# EasyEDA Pro project OpenArtV3改.eprj

# Schematic Schematic1
Create Date: 2023-12-01; Page Name: P1; Project Name: OpenArtV3改; Schematic Name: Schematic1; Update Date: 2024-03-08; Company: 嘉立创EDA; Page Size: A4; Version: V1.0
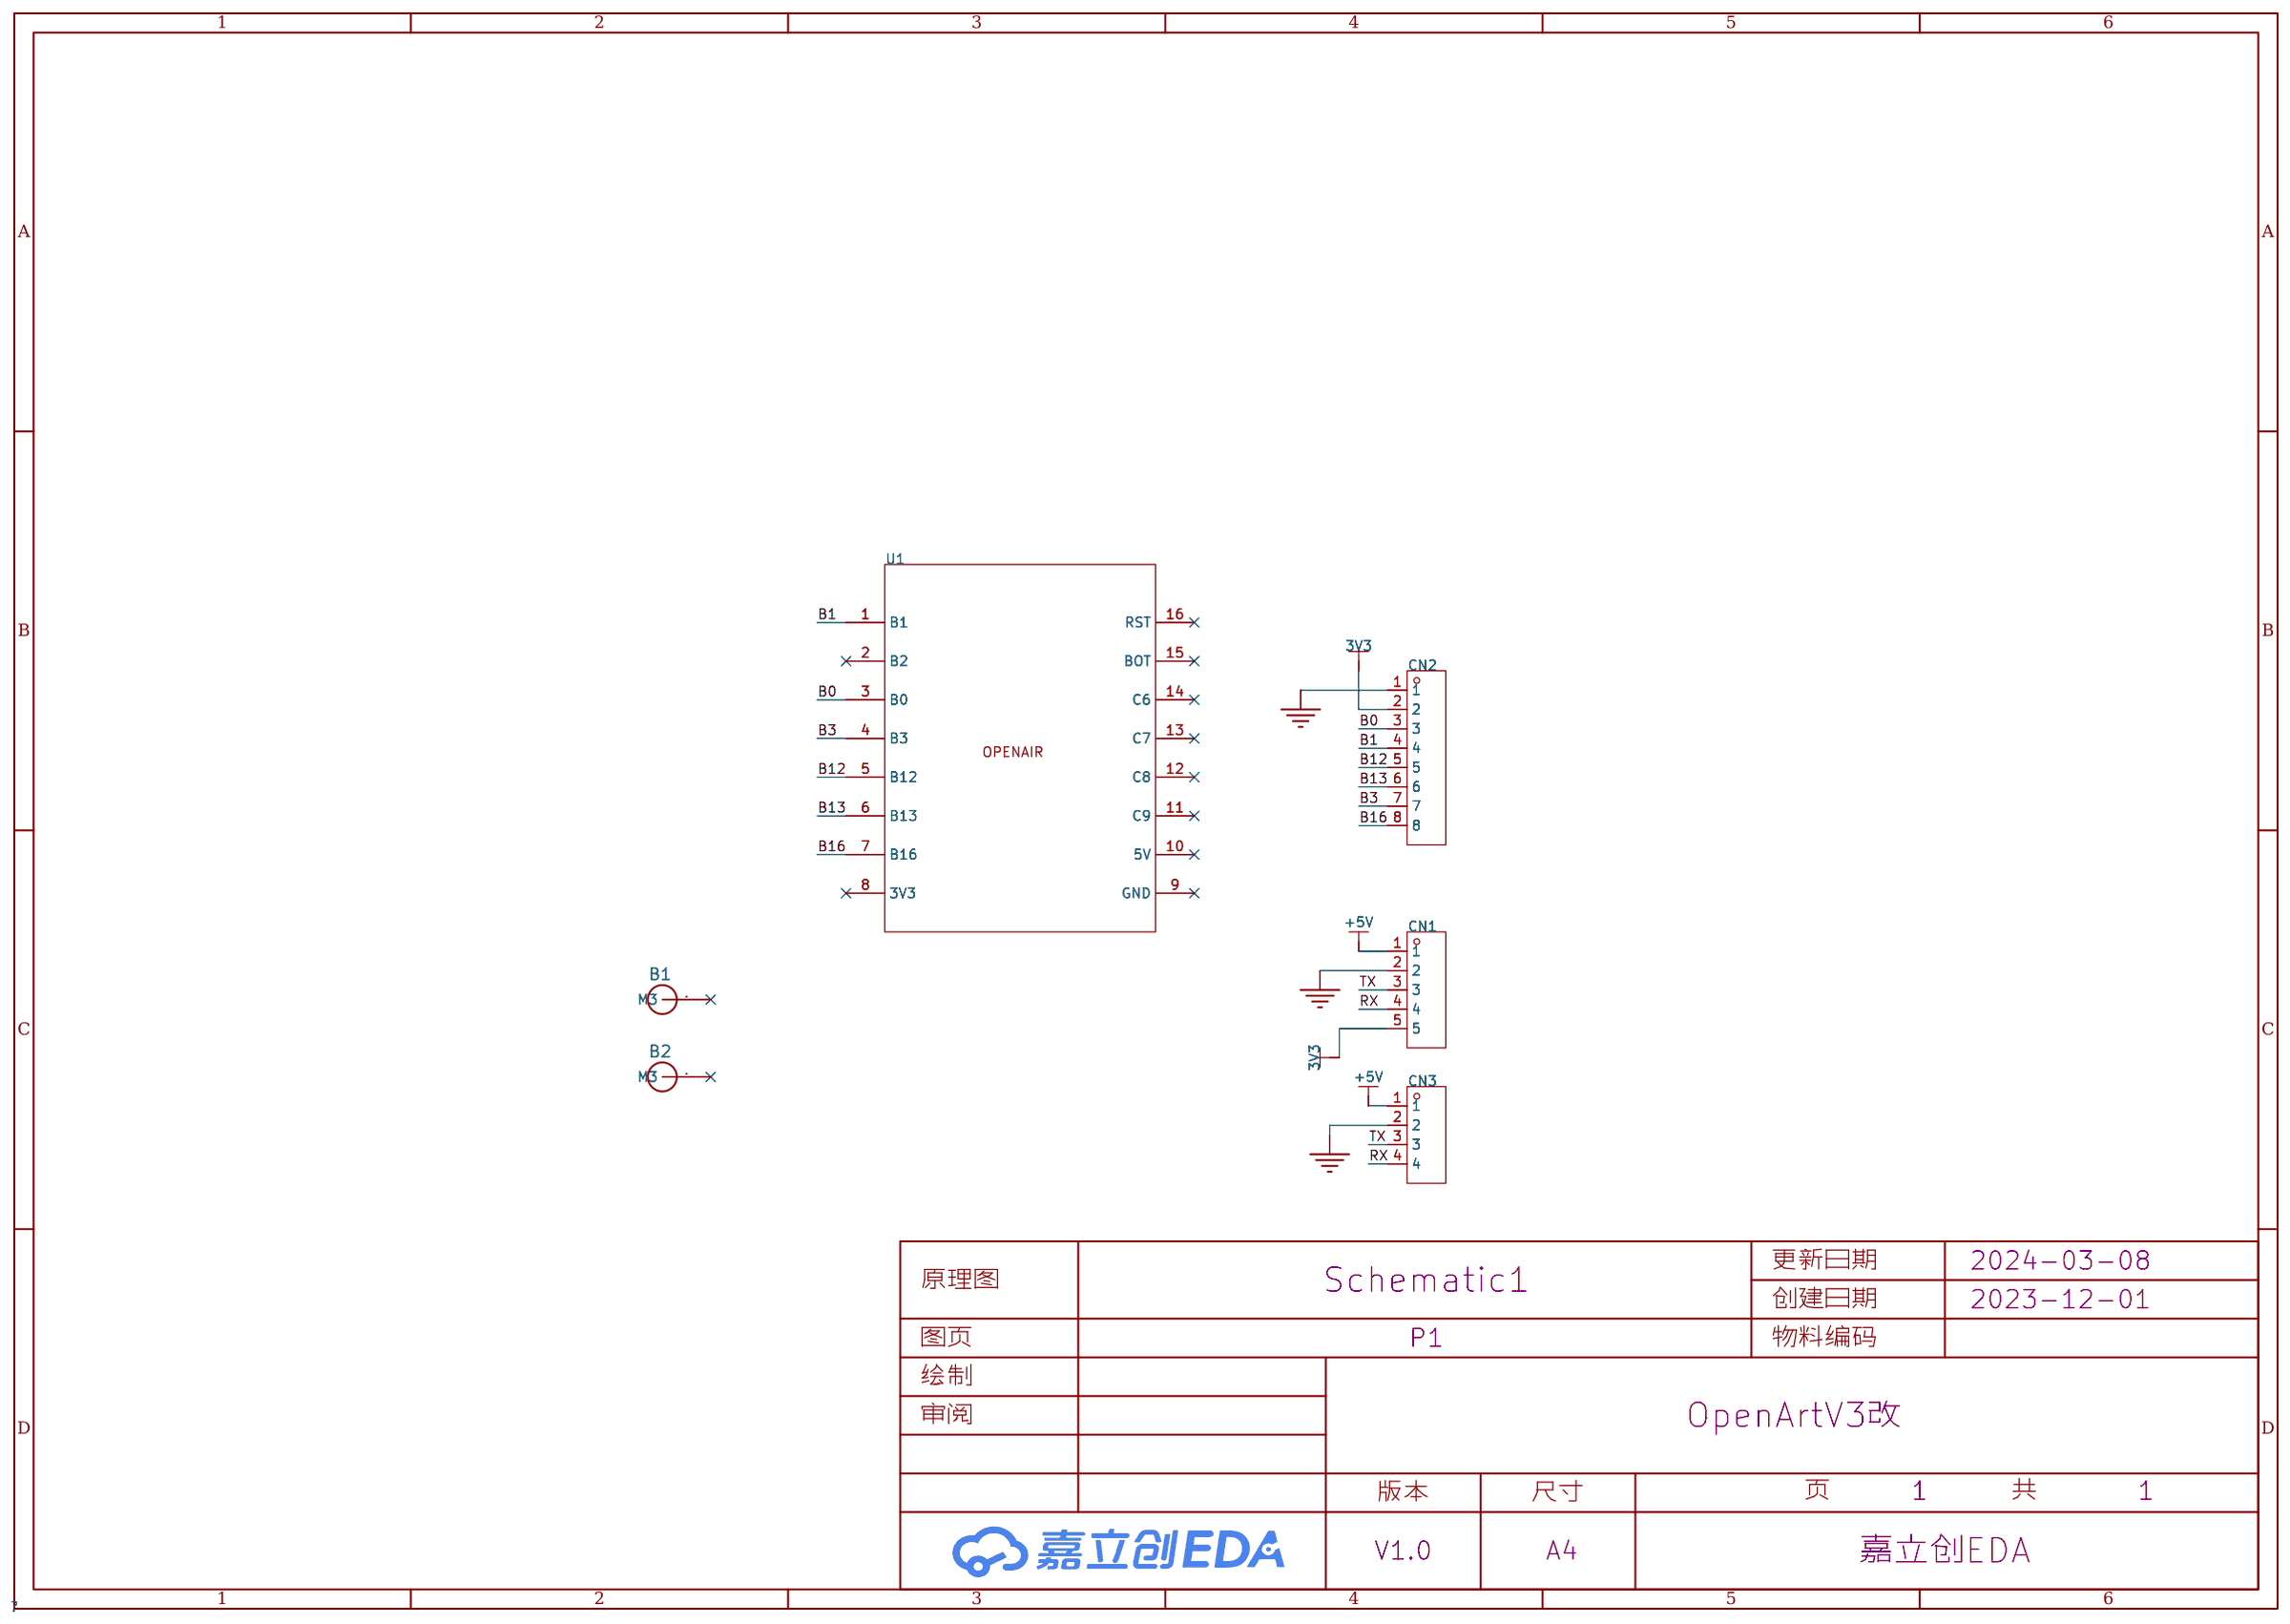
[diagram p0: schematic sheet]

## Parts
B1  M3螺柱孔_JX  [M3]
B2  M3螺柱孔_JX  [M3]
CN1  ZX-HA2.54-5PWZ  [CONN-TH_5P-P2.50_ZX-HA2.54-5PWZ]
CN2  BX-XH2.54-8PZZ  [CONN-TH_8P-P2.50_BX-XH2.54-8PZZ]
CN3  ZX-XH2.54-4PWZ  [CONN-TH_4P-P2.50_ZX-XH2.54-4PWZ]
U1  -  [OPENAIR]

## Library data of the parts
B1 B2 = M3螺柱孔_JX
CN1 = ZX-HA2.54-5PWZ: 插针结构:1x5P;间距:2.54mm;安装方式:弯插;参考系列:XH;总PIN数:5P;排数:1;每排PIN数:5;行距:-;额定电流:3A;触头材质:黄铜;触头镀层:锡;工作温度范围:-25℃~+85℃;; LCSC Part Name: 1x5P 间距:2.54mm 弯插 系列:XH/HA带扣; Supplier Part: C7429626; Manufacturer: Megastar(兆星); Supplier Footprint: 弯插,P=2.54mm; JLCPCB Part Class: 扩展库; Datasheet: https://atta.szlcsc.com/upload/public/pdf/source/20230619/9F9409DD07EAA554DDDE11B7E7BFEFE1.pdf; Supplier: LCSC; Pins Structure: 1x5P; Pitch: 2.54mm; Mounting Style: 弯插; Reference Series: XH; Number of Pins: 5P; Number of Rows: 1; Number of PINs Per Row: 5; Current Rating (Max): 3A; Contact Material: 黄铜; Contact Plating: 锡; Operating Temperature Range: -25℃~+85℃
CN2 = BX-XH2.54-8PZZ: 插针结构:1x8P;间距:2.54mm;安装方式:直插;参考系列:XH;总PIN数:8P;排数:1;每排PIN数:8;行距:-;额定电流:3A;触头材质:黄铜;触头镀层:锡;工作温度范围:-25℃~+85℃;; Supplier Part: C18077839; Manufacturer: Bossie(博锡); Supplier Footprint: 插件,P=2.54mm; JLCPCB Part Class: 扩展库; Datasheet: https://atta.szlcsc.com/upload/public/pdf/source/20231017/CBB233C5B4BF7FAD492668A18B6464FA.pdf; Supplier: LCSC; Pins Structure: 1x8P; Pitch: 2.54mm; Mounting Style: 直插; Reference Series: XH; Number of Pins: 8P; Number of Rows: 1; Number of PINs Per Row: 8; Current Rating (Max): 3A; Contact Material: 黄铜; Contact Plating: 锡; Operating Temperature Range: -25℃~+85℃
CN3 = ZX-XH2.54-4PWZ: 插针结构:1x4P;间距:2.54mm;安装方式:弯插;参考系列:XH;总PIN数:4P;排数:1;每排PIN数:4;行距:-;额定电流:3A;触头材质:黄铜;触头镀层:锡;工作温度范围:-25℃~+85℃;; Supplier Part: C7429643; Manufacturer: Megastar(兆星); Supplier Footprint: 弯插,P=2.54mm; JLCPCB Part Class: 扩展库; Datasheet: https://atta.szlcsc.com/upload/public/pdf/source/20230619/8DC602C7BA46C153FF1BE89D90453879.pdf; Supplier: LCSC; Pins Structure: 1x4P; Pitch: 2.54mm; Mounting Style: 弯插; Reference Series: XH; Number of Pins: 4P; Number of Rows: 1; Number of PINs Per Row: 4; Current Rating (Max): 3A; Contact Material: 黄铜; Contact Plating: 锡; Operating Temperature Range: -25℃~+85℃
U1 = OPENAIR

## Nets
3V3: CN1.5 CN2.2
+5V: CN1.1 CN3.1
GND: CN1.2 CN2.1 CN3.2
B0: CN2.3 U1.3(B0)
B1: CN2.4 U1.1(B1)
B3: CN2.7 U1.4(B3)
B12: CN2.5 U1.5(B12)
B13: CN2.6 U1.6(B13)
B16: CN2.8 U1.7(B16)
RX: CN1.4 CN3.4
TX: CN1.3 CN3.3

Not connected (* = marked no-connect by the designer): B1 1(M3)*; B2 1(M3)*; U1 2(B2)* 8(3V3)* 9(GND)* 10(5V)* 11(C9)* 12(C8)* 13(C7)* 14(C6)* 15(BOT)* 16(RST)*

# Board PCB1
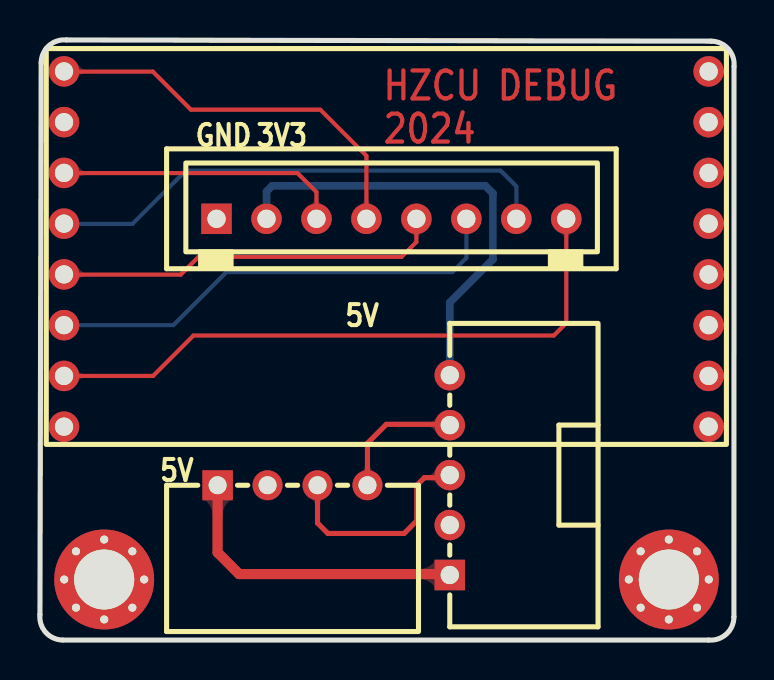
[diagram p1: board, top side]
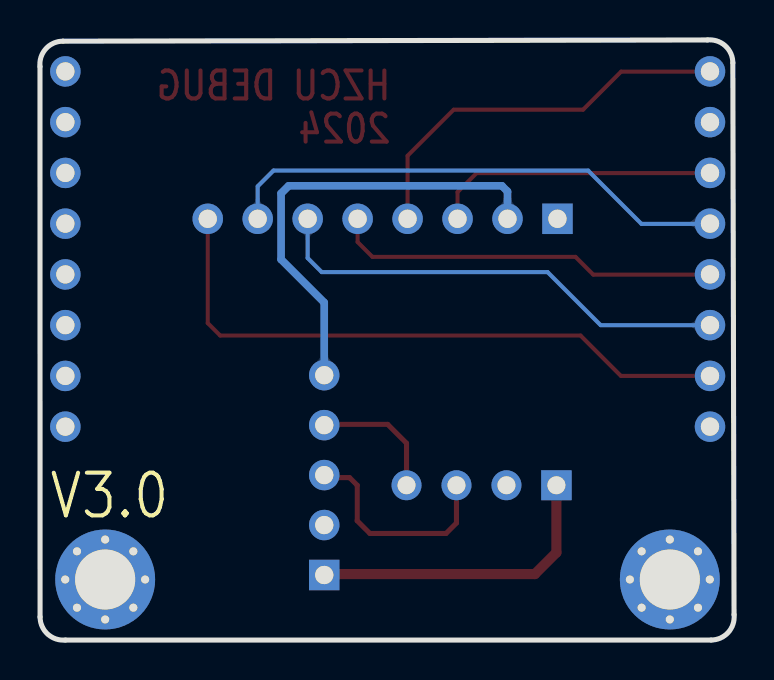
[diagram p2: board, bottom side, seen from below]

Outline 34.73 x 30.03 mm; copper layers: Top Layer, Bottom Layer. Coordinates in mm from the lower left corner of the outline.
Outline path: 0,1.27 0.06,28.89 arc(0.44,29.74) 1.33,30.03 33.59,29.97 arc(34.44,29.59) 34.73,28.7 34.73,1.16 arc(34.35,0.3) 33.46,0 1.14,0 arc(0.29,0.38) 0,1.27
Stack: Top Layer 0.035mm / Dielectric1 1.51mm FR4 er 4.5 / Bottom Layer 0.035mm

## Design rules (mm)
template: JLCPCB Capability(Two Layers Board)
spacing copperThickness1oz (default): track to track 0.102, other pairs 0.152 to 0.3
spacing copperThickness2oz: track to track 0.203, other pairs 0.152 to 0.3
track width copperThickness1oz (default): min 0.127, default 0.254, max 2.54
track width copperThickness2oz: min 0.203, default 0.254, max 2.54
differential pair differentialPair (default): width min 0.127, default 0.254, max 2.54; gap min 0.152, default 0.152
via viaSize (default): diameter min 0.5, default 0.61, max 10; hole min 0.3, default 0.305, max 6.3

## Placement (name value [footprint] x y rotation side)
B1  M3螺柱孔_JX  [M3]  3.21 3.03 0 top
B2  M3螺柱孔_JX  [M3]  31.47 3.03 0 top
CN1  ZX-HA2.54-5PWZ  [CONN-TH_5P-P2.50_ZX-HA2.54-5PWZ]  20.51 8.26 90 top
CN2  BX-XH2.54-8PZZ  [CONN-TH_8P-P2.50_BX-XH2.54-8PZZ]  17.59 21.08 0 top
CN3  ZX-XH2.54-4PWZ  [CONN-TH_4P-P2.50_ZX-XH2.54-4PWZ]  12.64 7.75 0 top
U1  -  [OPENAIR]  1.2 10.68 0 top

## Footprints (pads in the part's own frame, mm; a bottom-side part is the same pattern mirrored in y, then rotated)
CONN-TH_4P-P2.50_ZX-XH2.54-4PWZ
  rect 1.524x1.5 hole 0.9: 1(-3.75,0)
  round 1.5 hole 0.9: 2(-1.25,0) 3(1.25,0) 4(3.75,0)
CONN-TH_5P-P2.50_ZX-HA2.54-5PWZ
  rect 1.524x1.524 hole 0.914: 1(-5,0)
  round 1.524 hole 0.914: 2(-2.5,0) 3(0,0) 4(2.5,0) 5(5,0)
CONN-TH_8P-P2.50_BX-XH2.54-8PZZ
  rect 1.524x1.524 hole 0.914: 1(-8.75,0)
  round 1.524 hole 0.914: 2(-6.25,0) 3(-3.75,0) 4(-1.25,0) 5(1.25,0) 6(3.75,0) 7(6.25,0) 8(8.75,0)
M3
  round 0.6 hole 0.405x0.4: 1(-2,0) 1(-1.41,1.409) 1(-1.41,-1.41) 1(0,2) 1(0,-2) 1(1.41,1.409) 1(1.41,-1.41) 1(2,0)
  round 5 hole 3.005x3: 1(0,0)
OPENAIR
  round 1.524 hole 0.914: 1(0,17.78) 2(0,15.24) 3(0,12.7) 4(0,10.16) 5(0,7.62) 6(0,5.08) 7(0,2.54) 8(0,0) 9(32.258,0) 10(32.258,2.54) 11(32.258,5.08) 12(32.258,7.62) 13(32.258,10.16) 14(32.258,12.7) 15(32.258,15.24) 16(32.258,17.78)

## Nets
As in the schematic.

Pads without a net: B1 1; B2 1; U1 2 8 9 10 11 12 13 14 15 16

## Routing (per net, layer and track width the routed paths; a pad name or vN(x,y) marks a point on that pad's centre or on a via; arc(x,y) is an arc through that point)
3V3: length 23
  Bottom Layer w0.381: CN2.2 11.34,22.45 11.62,22.73 22.29,22.73 22.67,22.35 22.67,19.05 20.51,16.89 CN1.5
+5V: length 15.5
  Top Layer w0.508: CN3.1 8.89,4.38 9.97,3.3 20.46,3.3 CN1.1
B0: length 14.4
  Top Layer w0.203: CN2.3 13.84,22.42 12.89,23.37 1.21,23.37 U1.3
B1: length 20
  Top Layer w0.203: CN2.4 16.34,24.24 14.03,26.54 7.55,26.54 5.65,28.45 1.21,28.45 U1.1
B3: length 25.7
  Bottom Layer w0.203: U1.4 1.21,20.83 4.63,20.83 7.3,23.5 23.05,23.5 23.84,22.71 CN2.7
B12: length 19.5
  Top Layer w0.203: U1.5 1.21,18.29 7.05,18.29 7.93,19.18 18.09,19.18 18.84,19.92 CN2.5
B13: length 23.5
  Bottom Layer w0.203: CN2.6 21.34,19.12 20.63,18.42 9.33,18.42 6.68,15.76 U1.6
B16: length 31.4
  Top Layer w0.203: U1.7 5.66,13.22 7.68,15.24 25.71,15.24 26.34,15.86 CN2.8
RX: length 6.6
  Top Layer w0.254: CN1.4 20.47,10.8 17.33,10.8 16.39,9.85 CN3.4
TX: length 11
  Top Layer w0.254: CN1.3 20.38,8.13 19.24,8.13 18.86,7.75 18.86,5.97 18.22,5.33 14.41,5.33 13.89,5.86 CN3.3

## Copper pours and planes (outline as drawn; the poured copper is in the pictures)
GND on Top Layer: -2.1,32.39 36.26,32.39 36.26,-1.52 -2.1,-1.52
GND on Bottom Layer: -2.1,32.39 36.26,32.39 36.26,-1.52 -2.1,-1.52

Small or netless copper shapes (teardrops, artwork), in the pictures only: 14 on Top Layer, 6 on Bottom Layer

## Text on the board
Bottom Silkscreen Layer: V3.0
Top Layer: HZCU | 2024 | DEBUG
Top Solder Mask Layer: HZCU | 2024 | DEBUG
Top Silkscreen Layer: 5V | GND | 3V3
